# EAGLE design VM-MCU_v4.5 (EAGLE 9.6.2)

## Sheet 1 of 2
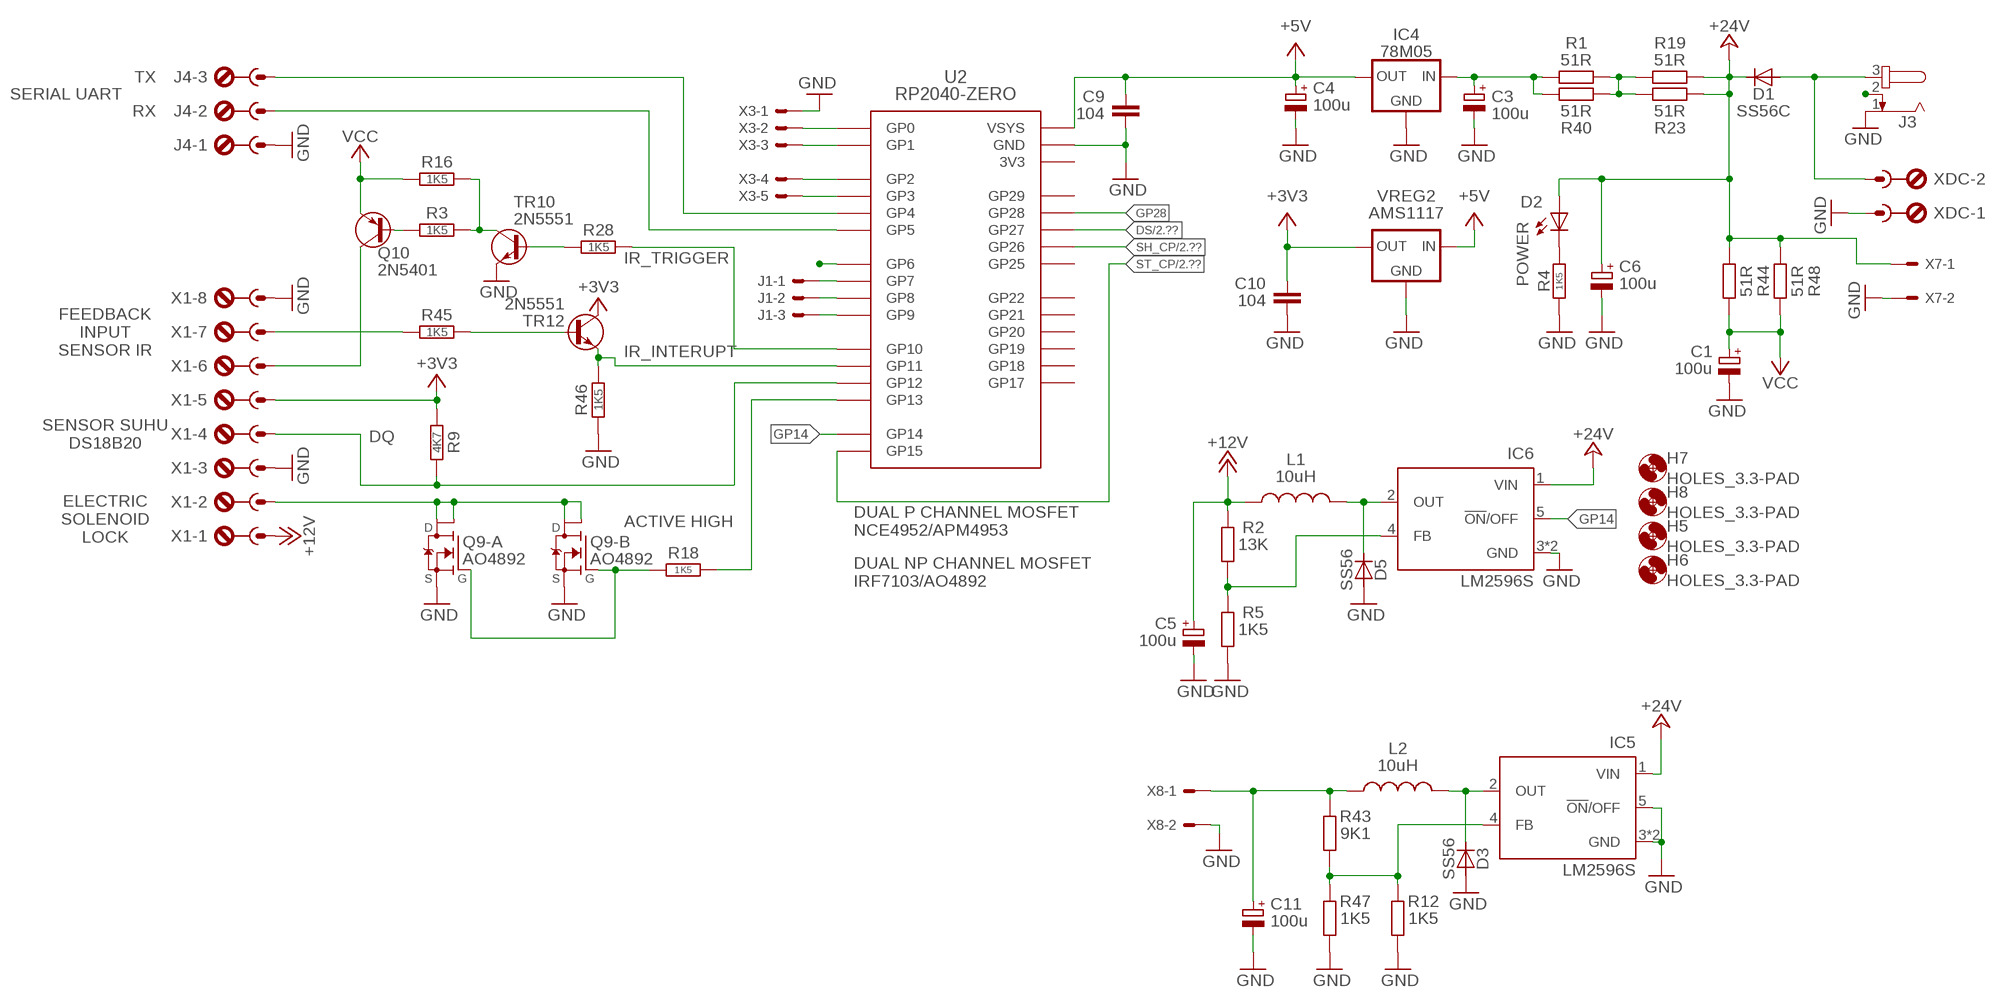
[diagram p0: schematic, sheet 1]

### Parts
C1  100u  ELCO_UD-6,3X7,7  [UD-6,3X7,7_NICHICON]
C3  100u  ELCO_UD-6,3X7,7  [UD-6,3X7,7_NICHICON]
C4  100u  ELCO_UD-6,3X7,7  [UD-6,3X7,7_NICHICON]
C5  100u  ELCO_UD-6,3X7,7  [UD-6,3X7,7_NICHICON]
C6  100u  ELCO_UD-6,3X7,7  [UD-6,3X7,7_NICHICON]
C9  104  CAP_SMD-C1206  [C1206]
C10  104  CAP_SMD-C1206  [C1206]
C11  100u  ELCO_UD-6,3X7,7  [UD-6,3X7,7_NICHICON]
D1  SS56C  DIODE_DO214AB-SMC  [DO214AB]
D2  POWER  LED2835  [LED2835]
D3  SS56  DIODE_DO214AC  [DO214AC]
D5  SS56  DIODE_DO214AC  [DO214AC]
H5  HOLES_3.3-PAD  [3,3-PAD]
H6  HOLES_3.3-PAD  [3,3-PAD]
H7  HOLES_3.3-PAD  [3,3-PAD]
H8  HOLES_3.3-PAD  [3,3-PAD]
IC4  78M05  78XXX_TO252  [TO252]
IC5  LM2596S  [TO263-5]
IC6  LM2596S  [TO263-5]
J1  SOKET-3P_JST-XH-2.54  [3P-JST-XH]
J3  JACK-DC_5.5X2.5MM  [DC-5.5X2.5]
J4  TBLOCK-3P_KF2EDG-3.81  [KF2EDG-3.81_3P]
L1  10uH  INDUKTORSMD  [CDRH127/LD]
L2  10uH  INDUKTORSMD  [CDRH127/LD]
Q9  AO4892  DUALFET-N_AO4892N+N  [SO-8]
Q10  2N5401  BJT-PNP_TO92-EBC  [TO92-EBC]
R1  51R  RESISTOR_2512  [R2512]
R2  13K  RESISTOR_1206  [R1206]
R3  1K5  RESISTOR_1206  [R1206]
R4  1K5  RESISTOR_1206  [R1206]
R5  1K5  RESISTOR_1206  [R1206]
R9  4K7  RESISTOR_1206  [R1206]
R12  1K5  RESISTOR_1206  [R1206]
R16  1K5  RESISTOR_1206  [R1206]
R18  1K5  RESISTOR_1206  [R1206]
R19  51R  RESISTOR_2512  [R2512]
R23  51R  RESISTOR_2512  [R2512]
R28  1K5  RESISTOR_1206  [R1206]
R40  51R  RESISTOR_2512  [R2512]
R43  9K1  RESISTOR_1206  [R1206]
R44  51R  RESISTOR_2512  [R2512]
R45  1K5  RESISTOR_1206  [R1206]
R46  1K5  RESISTOR_1206  [R1206]
R47  1K5  RESISTOR_1206  [R1206]
R48  51R  RESISTOR_2512  [R2512]
TR10  2N5551  BJT-NPN_TO92-EBC  [TO92-EBC]
TR12  2N5551  BJT-NPN_TO92-EBC  [TO92-EBC]
U2  RP2040-ZERO  RASPBERRY-PICO-ZERO-SMT_TYPE-C  [PICO-ZERO-SMT-C]
VREG2  AMS1117  78XXX_SOT223  [SOT223]
X1  TBLOCK-8P_KF2EDG-3.81  [KF2EDG-3.81_8P]
X3  SOKET-5P_JST-XH-2.54  [5P-JST-XH]
X7  SOKET-2P_JST-XH-2.54  [2P-JST-XH]
X8  SOKET-2P_JST-XH-2.54  [2P-JST-XH]
XDC  TBLOCK-2P_5.08MM  [KF128-5_2P]

### Nets
+3V3: C10.1 R9.1 TR12.C VREG2.4(OUT) X1.5
+5V: C4.+ C9.1 IC4.2(OUT) U2.5V(VSYS) VREG2.3(IN) ; also sheet 2
+12V: C5.+ L1.1 R2.1 X1.1
+24V: C6.+ D1.C D2.A IC5.1(VIN) IC6.1(VIN) R19.2 R23.1 R44.1 R48.1 X7.1 ; also sheet 2
DS: U2.P27(GP27) ; also sheet 2
GND: C1.- C3.- C4.- C5.- C6.- C9.2 C10.2 C11.- D3.A D5.A IC4.3(GND) IC5.3(GND) IC5.5(!ON!/OFF) IC5.6(GND) IC6.3(GND) IC6.6(GND) J3.1 J4.1 Q9.1(-A:S) Q9.3(-B:S) R4.1 R5.2 R12.2 R46.1 R47.2 TR10.E U2.G(GND) VREG2.1(GND) X1.3 X1.8 X3.1 X7.2 X8.2 XDC.1 ; also sheet 2
GP7: J1.1 U2.P7(GP7)
GP8_TX: J1.2 U2.P8(GP8)
GP9_RX: J1.3 U2.P9(GP9)
GP12: R9.2 U2.P12(GP12) X1.4
GP14: IC6.5(!ON!/OFF) U2.P14(GP14)
GP28: U2.P28(GP28)
N$1: J4.3 U2.P4(GP4)
N$2: J4.2 U2.P5(GP5)
N$3: D1.A J3.3 XDC.2
N$4: D2.C R4.2
N$5: C3.+ IC4.1(IN) R1.1 R40.2
N$6: R3.2 R16.2 TR10.C
N$7: Q10.B R3.1
N$8: R1.2 R19.1 R23.2 R40.1
N$10: U2.P6(GP6)
N$13: U2.P1(GP1) X3.3
N$23: Q10.E X1.6
N$25: U2.P0(GP0) X3.2
N$33: Q9.2(-A:G) Q9.4(-B:G) R18.2
N$34: D3.C IC5.2(OUT) L2.2
N$43: J3.2
N$46: U2.P2(GP2) X3.4
N$47: U2.P3(GP3) X3.5
N$53: C11.+ L2.1 R43.1 X8.1
N$60: Q9.5(-B:D1) Q9.6(-B:D2) Q9.7(-A:D2) Q9.8(-A:D1) X1.2
N$68: D5.C IC6.2(OUT) L1.2
N$71: IC6.4(FB) R2.2 R5.1
N$72: IC5.4(FB) R12.1 R43.2 R47.1
N$73: R28.1 TR10.B
N$74: R45.1 TR12.B
N$86: R45.2 X1.7
P10: R28.2 U2.P10(GP10)
P11: R46.2 TR12.E U2.P11(GP11)
P13: R18.1 U2.P13(GP13)
SH_CP: U2.P26(GP26) ; also sheet 2
ST_CP: U2.P15(GP15) ; also sheet 2
VCC: C1.+ Q10.C R16.1 R44.2 R48.2
Unconnected: U2.P17(GP17) U2.P18(GP18) U2.P19(GP19) U2.P20(GP20) U2.P21(GP21) U2.P22(GP22) U2.P25(GP25) U2.P29(GP29)

### Notes on the sheet
- TX
- SERIAL UART
- RX
- IR_TRIGGER
- FEEDBACK
  INPUT
  SENSOR IR
- IR_INTERUPT
- SENSOR SUHU
  DS18B20
- DQ
- ELECTRIC
  SOLENOID
  LOCK
- ACTIVE HIGH
- DUAL P CHANNEL MOSFET
  NCE4952/APM4953
- DUAL NP CHANNEL MOSFET
  IRF7103/AO4892

## Sheet 2 of 2
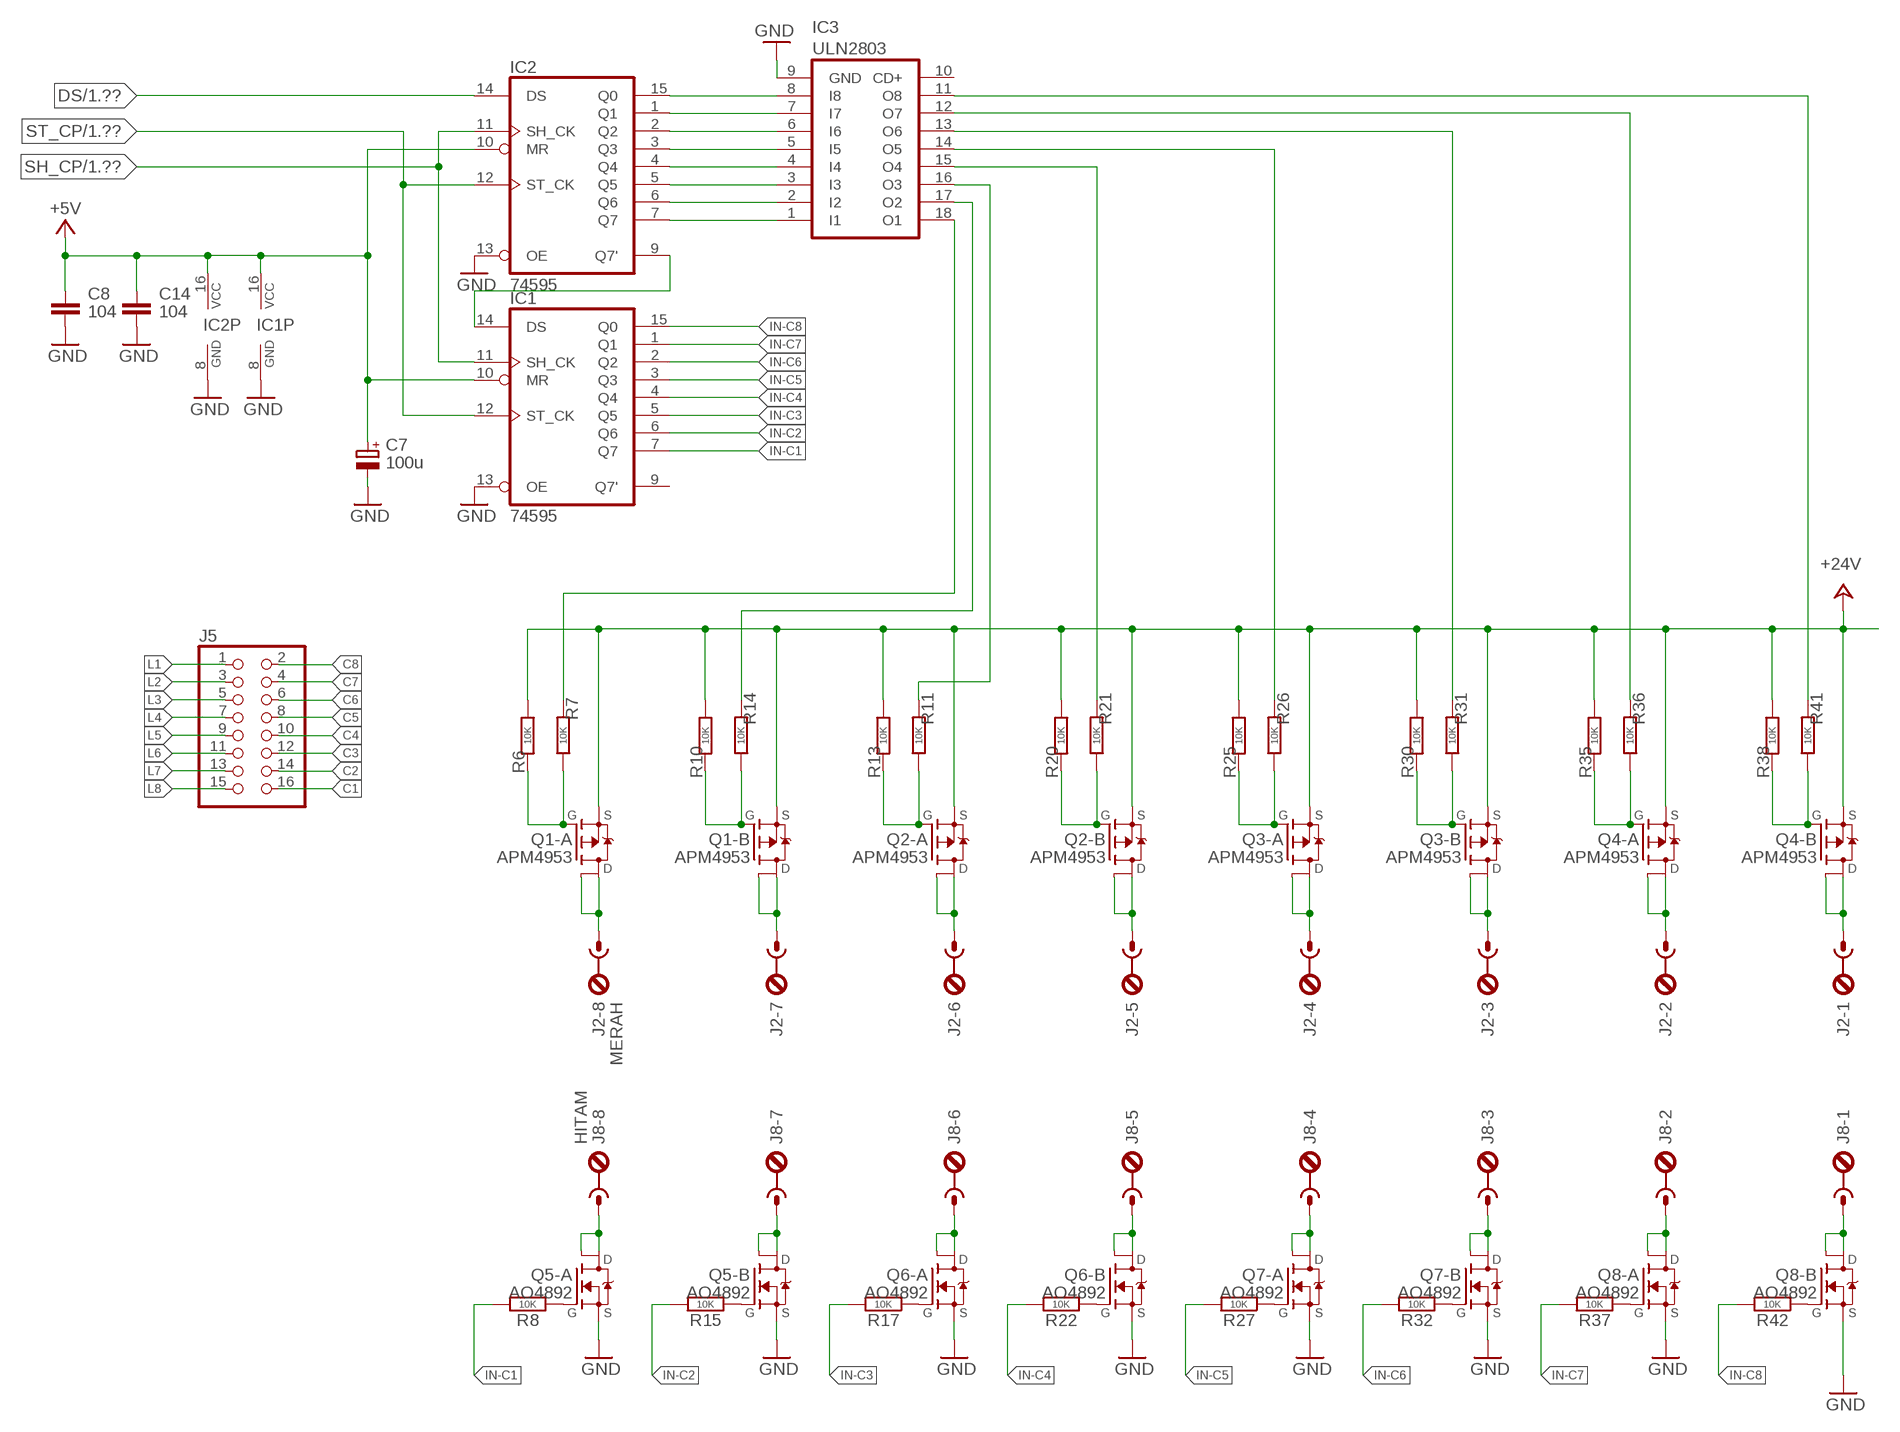
[diagram p1: schematic, sheet 2]

### Parts
C7  100u  ELCO_UD-6,3X7,7  [UD-6,3X7,7_NICHICON]
C8  104  CAP_SMD-C1206  [C1206]
C14  104  CAP_SMD-C1206  [C1206]
IC1  74595  [SO16]
IC2  74595  [SO16]
IC3  ULN2803  ULN2805ASO18  [SO18W]
J2  MERAH  TBLOCK-8P_KF2EDG-3.81  [KF2EDG-3.81_8P]
J5  PINHEAD_2X8SMT  [PINHEAD-SMT_2X08]
J8  HITAM  TBLOCK-8P_KF2EDG-3.81  [KF2EDG-3.81_8P]
Q1  APM4953  DUALFET-P_NCE4953P+P  [SO-8]
Q2  APM4953  DUALFET-P_NCE4953P+P  [SO-8]
Q3  APM4953  DUALFET-P_NCE4953P+P  [SO-8]
Q4  APM4953  DUALFET-P_NCE4953P+P  [SO-8]
Q5  AO4892  DUALFET-N_AO4892N+N  [SO-8]
Q6  AO4892  DUALFET-N_AO4892N+N  [SO-8]
Q7  AO4892  DUALFET-N_AO4892N+N  [SO-8]
Q8  AO4892  DUALFET-N_AO4892N+N  [SO-8]
R6  10K  RESISTOR_1206  [R1206]
R7  10K  RESISTOR_1206  [R1206]
R8  10K  RESISTOR_1206  [R1206]
R10  10K  RESISTOR_1206  [R1206]
R11  10K  RESISTOR_1206  [R1206]
R13  10K  RESISTOR_1206  [R1206]
R14  10K  RESISTOR_1206  [R1206]
R15  10K  RESISTOR_1206  [R1206]
R17  10K  RESISTOR_1206  [R1206]
R20  10K  RESISTOR_1206  [R1206]
R21  10K  RESISTOR_1206  [R1206]
R22  10K  RESISTOR_1206  [R1206]
R25  10K  RESISTOR_1206  [R1206]
R26  10K  RESISTOR_1206  [R1206]
R27  10K  RESISTOR_1206  [R1206]
R30  10K  RESISTOR_1206  [R1206]
R31  10K  RESISTOR_1206  [R1206]
R32  10K  RESISTOR_1206  [R1206]
R35  10K  RESISTOR_1206  [R1206]
R36  10K  RESISTOR_1206  [R1206]
R37  10K  RESISTOR_1206  [R1206]
R38  10K  RESISTOR_1206  [R1206]
R41  10K  RESISTOR_1206  [R1206]
R42  10K  RESISTOR_1206  [R1206]

### Nets
+5V: C7.+ C8.1 C14.1 IC1.10(MR) IC1.16(VCC) IC2.10(MR) IC2.16(VCC) ; also sheet 1
+24V: Q1.1(-A:S) Q1.3(-B:S) Q2.1(-A:S) Q2.3(-B:S) Q3.1(-A:S) Q3.3(-B:S) Q4.1(-A:S) Q4.3(-B:S) R6.1 R10.1 R13.1 R20.1 R25.1 R30.1 R35.1 R38.1 ; also sheet 1
C1: J5.16 J8.8 Q5.7(-A:D2) Q5.8(-A:D1)
C2: J5.14 J8.7 Q5.5(-B:D1) Q5.6(-B:D2)
C3: J5.12 J8.6 Q6.7(-A:D2) Q6.8(-A:D1)
C4: J5.10 J8.5 Q6.5(-B:D1) Q6.6(-B:D2)
C5: J5.8 J8.4 Q7.7(-A:D2) Q7.8(-A:D1)
C6: J5.6 J8.3 Q7.5(-B:D1) Q7.6(-B:D2)
C7: J5.4 J8.2 Q8.7(-A:D2) Q8.8(-A:D1)
C8: J5.2 J8.1 Q8.5(-B:D1) Q8.6(-B:D2)
DS: IC2.14(DS) ; also sheet 1
GND: C7.- C8.2 C14.2 IC1.8(GND) IC1.13(OE) IC2.8(GND) IC2.13(OE) IC3.9(GND) Q5.1(-A:S) Q5.3(-B:S) Q6.1(-A:S) Q6.3(-B:S) Q7.1(-A:S) Q7.3(-B:S) Q8.1(-A:S) Q8.3(-B:S) ; also sheet 1
IN-C1: IC1.7(Q7) R8.2
IN-C2: IC1.6(Q6) R15.2
IN-C3: IC1.5(Q5) R17.2
IN-C4: IC1.4(Q4) R22.2
IN-C5: IC1.3(Q3) R27.2
IN-C6: IC1.2(Q2) R32.2
IN-C7: IC1.1(Q1) R37.2
IN-C8: IC1.15(Q0) R42.2
L1: J2.8 J5.1 Q1.7(-A:D2) Q1.8(-A:D1)
L2: J2.7 J5.3 Q1.5(-B:D1) Q1.6(-B:D2)
L3: J2.6 J5.5 Q2.7(-A:D2) Q2.8(-A:D1)
L4: J2.5 J5.7 Q2.5(-B:D1) Q2.6(-B:D2)
L5: J2.4 J5.9 Q3.7(-A:D2) Q3.8(-A:D1)
L6: J2.3 J5.11 Q3.5(-B:D1) Q3.6(-B:D2)
L7: J2.2 J5.13 Q4.7(-A:D2) Q4.8(-A:D1)
L8: J2.1 J5.15 Q4.5(-B:D1) Q4.6(-B:D2)
N$12: IC2.15(Q0) IC3.8(I8)
N$15: IC2.1(Q1) IC3.7(I7)
N$16: Q1.2(-A:G) R6.2 R7.1
N$18: IC3.17(O2) R14.2
N$19: Q5.2(-A:G) R8.1
N$20: Q1.4(-B:G) R10.2 R14.1
N$21: IC2.2(Q2) IC3.6(I6)
N$22: Q2.2(-A:G) R11.1 R13.2
N$26: IC2.3(Q3) IC3.5(I5)
N$27: Q5.4(-B:G) R15.1
N$29: IC2.4(Q4) IC3.4(I4)
N$31: IC3.18(O1) R7.2
N$32: Q2.4(-B:G) R20.2 R21.1
N$35: Q6.2(-A:G) R17.1
N$37: IC2.5(Q5) IC3.3(I3)
N$38: IC2.6(Q6) IC3.2(I2)
N$39: IC2.7(Q7) IC3.1(I1)
N$40: IC3.16(O3) R11.2
N$41: IC3.15(O4) R21.2
N$42: Q3.2(-A:G) R25.2 R26.1
N$44: Q6.4(-B:G) R22.1
N$48: IC3.14(O5) R26.2
N$49: Q3.4(-B:G) R30.2 R31.1
N$51: Q7.2(-A:G) R27.1
N$55: IC3.13(O6) R31.2
N$56: Q4.2(-A:G) R35.2 R36.1
N$58: Q7.4(-B:G) R32.1
N$62: IC3.12(O7) R36.2
N$63: Q4.4(-B:G) R38.2 R41.1
N$65: Q8.2(-A:G) R37.1
N$69: IC3.11(O8) R41.2
N$70: Q8.4(-B:G) R42.1
N$84: IC1.14(DS) IC2.9(Q7')
SH_CP: IC1.11(SH_CK) IC2.11(SH_CK) ; also sheet 1
ST_CP: IC1.12(ST_CK) IC2.12(ST_CK) ; also sheet 1
Unconnected: IC1.9(Q7') IC3.10(CD+)

## Power pins joined to a net without a drawn wire
3V3: U2.3V3

## Library data of the parts
C1 C3-C7 C11 = MyFavorite:ELCO_: POLARIZED CAPACITOR, European symbol; SPICEPREFIX: C
C8-C10 C14 = MyFavorite:CAP_: CAPACITOR, European symbol
D1 D3 D5 = MyFavorite:DIODE_
D2 = MyFavorite:LED
H5-H8 = MyFavorite:HOLES_: MOUNTING HOLE with drill center marker
IC1 IC2 = VM-MCU:74*595: 8-bit SHIFT REGISTER, output latch
IC3 = VM-MCU:ULN2805A: DRIVER ARRAY
IC4 VREG2 = VM-MCU:78XXX_: VOLTAGE REGULATOR
IC5 IC6 = VM-MCU:LM2596: SIMPLE SWITCHER® Power Converter 150 kHz 3A Step-Down Voltage Regulator Source: http://www.national.com/ds/LM/LM2596.pdf; MF: NATIONAL SEMICONDUCTOR; MPN: LM2596S-ADJ/NOPB; OC_FARNELL: 9494367; OC_NEWARK: 41K3842
J1 = MYConnector:SOKET-3P_: KK 156 HEADER Source: http://www.molex.com/pdm_docs/sd/026604100_sd.pdf
J2 J8 X1 = MYConnector:TBLOCK-8P_: PHOENIX
J3 = MyFavorite:JACK-DC_: DC POWER JACK Power Jack, DC, Right Angle, Through Hole, Rated 5A at 16VDC, PC Terminals Distributor: Farnell (www.Farnell.de) Drawing: 84N1161.pdf / 84N1162.pdf Manufacturer: SPC Technology (www.spctechnology.com) Type: SPC4077 / SPC 4078
J4 = MYConnector:TBLOCK-3P_
J5 = MYConnector:PINHEAD_2X8
L1 L2 = MyFavorite:INDUKTOR
Q1-Q4 = VM-MCU:DUALFET-P_
Q5-Q9 = VM-MCU:DUALFET-N_
Q10 = VM-MCU:BJT-PNP_: PNP Transistror
R1 R4 R6-R8 R10 R11 R13-R15 R17 R19-R23 R25-R27 R30-R32 R35-R38 R40-R42 R44 R45 R48 = MyFavorite:RESISTOR_: RESISTOR, European symbol
R2 R3 R5 R9 R12 R16 R18 R28 R43 R46 R47 = VM-MCU:RESISTOR_: RESISTOR, European symbol
TR10 TR12 = VM-MCU:BJT-NPN_: NPN Transistror BF959 corrected 2008.03.06
U2 = VM-MCU:RASPBERRY-PICO-ZERO-SMT_
X3 = MYConnector:SOKET-5P_: KK 156 HEADER Source: http://www.molex.com/pdm_docs/sd/026604100_sd.pdf
X7 X8 = MYConnector:SOKET-2P_: KK 156 HEADER Source: http://www.molex.com/pdm_docs/sd/026604100_sd.pdf
XDC = MYConnector:TBLOCK-2P_

## Board
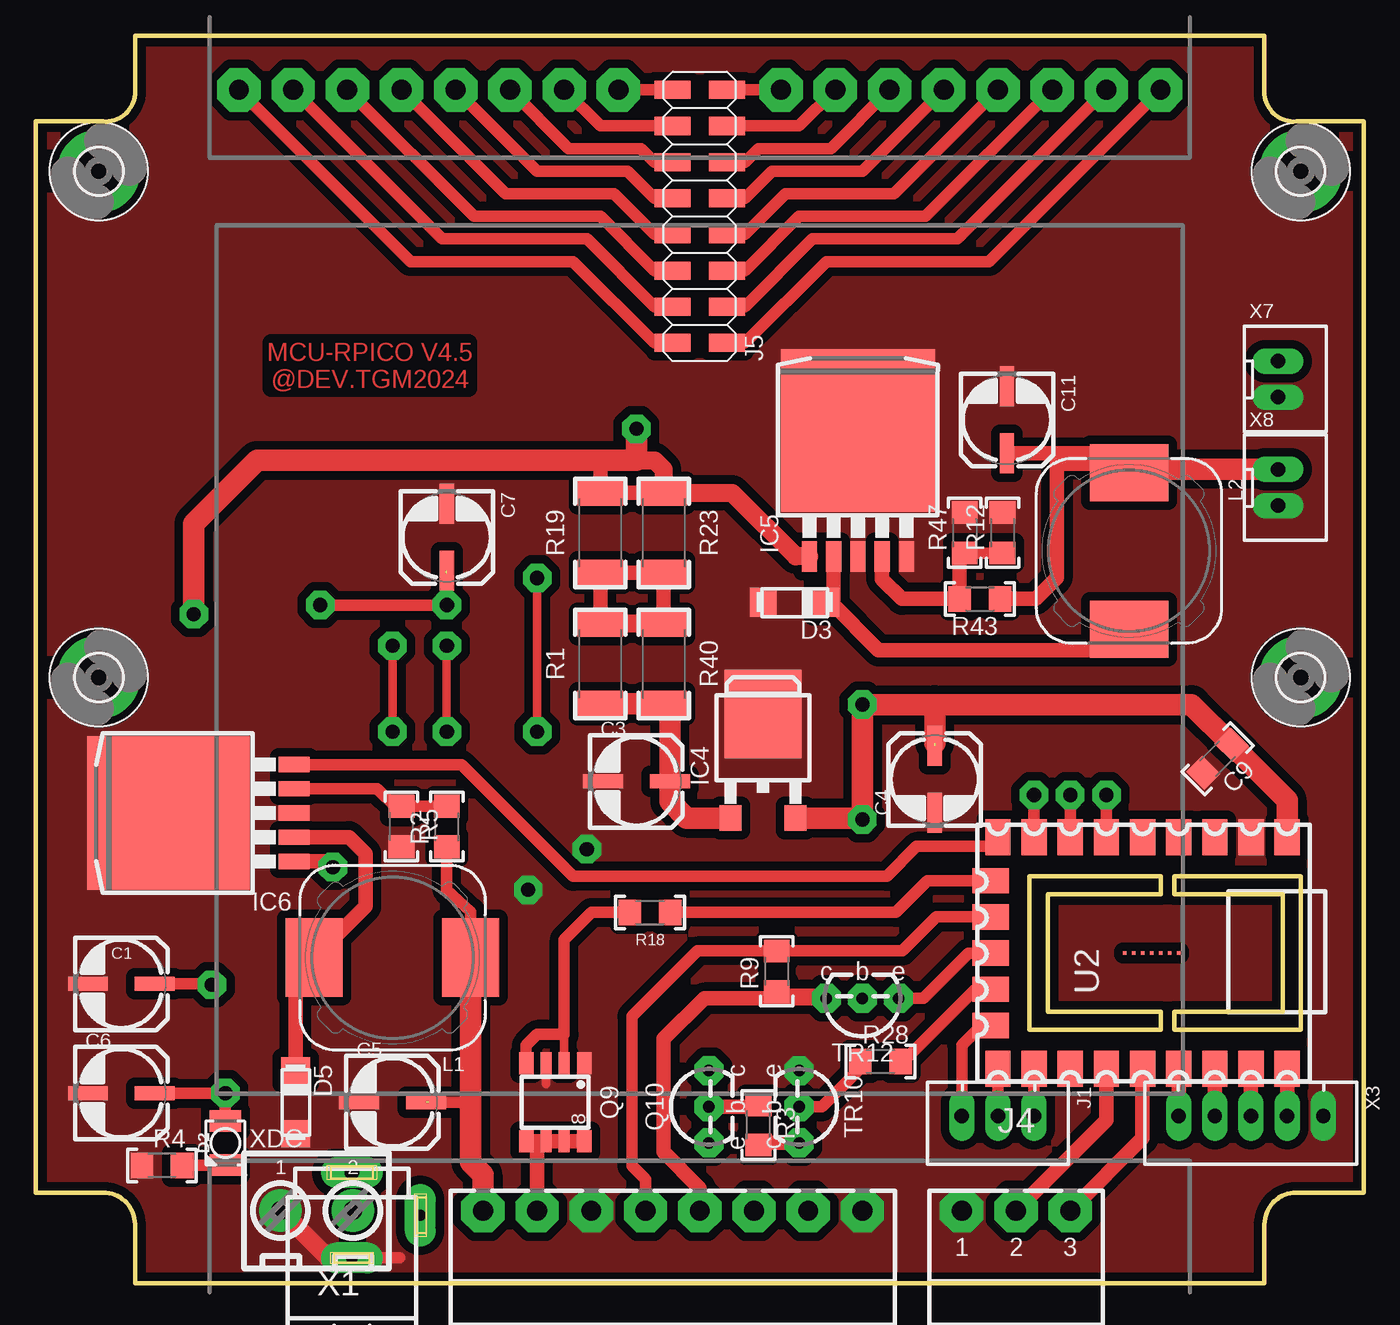
[diagram p2: board, top side]
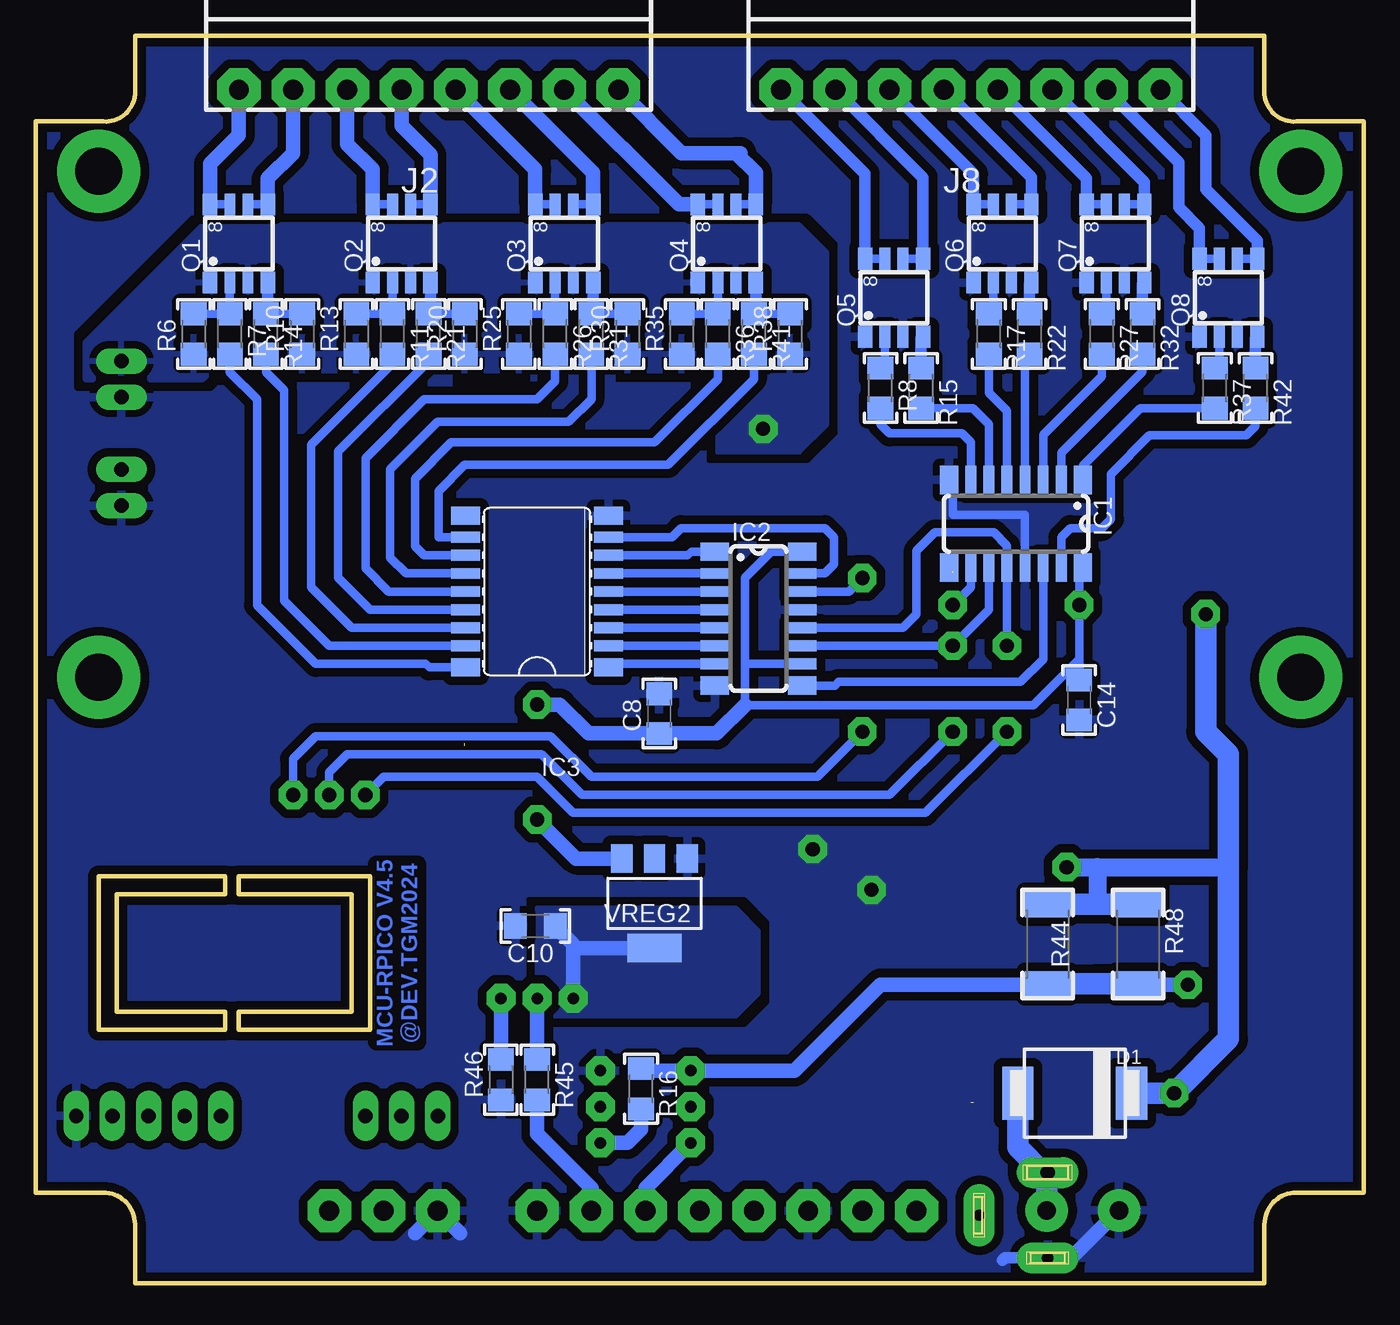
[diagram p3: board, bottom side, seen from below]

Size 93.34 x 87.63 mm. Coordinates in mm from the lower left corner, seen from the top.
Outline: 86.36,87.63 6.98,87.63 6.98,83.5 arc-90 4.76,81.6 0,81.6 0,6.35 4.76,6.35 arc-90 6.98,4.13 6.98,0 86.36,0 86.36,4.13 arc-90 88.58,6.35 93.35,6.35 93.35,81.6 88.58,81.6 arc-90 86.36,83.5 86.36,87.63
Outline: 69.85,28.57 69.85,17.78 79.06,17.78 79.06,19.05 71.12,19.05 71.12,27.3 79.06,27.3 79.06,28.57 69.85,28.57
Outline: 80.01,17.78 88.9,17.78 88.9,28.57 80.01,28.57 80.01,27.3 87.63,27.3 87.63,19.05 80.01,19.05 80.01,17.78
Copper layers (1*16): Top 0.035mm / dielectric 1.5mm / Bottom 0.035mm
Design rules "default *": minimum track width 6mil, minimum drill 0.35mm, track to track 24mil, track to pad 6mil, pad to pad 6mil, via to via 6mil, smd to smd 0mil, copper to edge 24mil, drill to drill 6mil, minimum pad ring 10mil, minimum via ring 8mil, stop-mask expansion 4mil, vias tented up to drill 0mil, thermal gap 20mil

### Footprints (pad centres in the part's own frame; a part is rotated, then mirrored left to right if it is on the bottom)
UD-6,3X7,7_NICHICON = smd 2.8 x 1: + 2.35,0; - -2.35,0
C1206 = smd 1.6 x 1.8: 1 -1.4,0; 2 1.4,0
DO214AB = smd 2.2 x 3.7: A 4,0; C -4,0
LED2835 = smd 1.5 x 2.2: A -1.55,0; C 1.55,0
DO214AC = smd 1.88 x 2.032: A 2.21,0; C -2.21,0
3,3-PAD = drill 3.3 pad 5.842: 3.3 0,0
SO16 = smd 1.27 x 2.032: 1 -4.699,-3.073; 8 4.699,-3.073; 9 4.699,3.073; 16 -4.699,3.073 | smd 0.762 x 2.032: 2 -3.175,-3.073; 3 -1.905,-3.073; 4 -0.635,-3.073; 5 0.635,-3.073; 6 1.905,-3.073; 7 3.175,-3.073; 10 3.175,3.073; 11 1.905,3.073; 12 0.635,3.073; 13 -0.635,3.073; 14 -1.905,3.073; 15 -3.175,3.073
SO18W = smd 1.27 x 2.032: 1 -5.334,-5.029; 9 5.334,-5.029; 10 5.334,5.029; 18 -5.334,5.029 | smd 0.762 x 2.032: 2 -3.81,-5.029; 3 -2.54,-5.029; 4 -1.27,-5.029; 5 0,-5.029; 6 1.27,-5.029; 7 2.54,-5.029; 8 3.81,-5.029; 11 3.81,5.029; 12 2.54,5.029; 13 1.27,5.029; 14 0,5.029; 15 -1.27,5.029; 16 -2.54,5.029; 17 -3.81,5.029
TO252 = smd 1.524 x 1.778: 1 -2.28,-4.8; 2 2.28,-4.8 | smd 5.4 x 6.2: 3 0,2.5
TO263-5 = smd 1.067 x 2.159: 1 -3.404,-5.791; 2 -1.702,-5.791; 3 0,-5.791; 4 1.702,-5.791; 5 3.404,-5.791 | smd 10.8 x 11.43: 6 0,3.048
3P-JST-XH = drill 1.016 pad 1.778 long: 1 -2.54,0; 2 0,0; 3 2.54,0
KF2EDG-3.81_8P = drill 1.4 pad 3.048 octagon: 1 0,0; 2 3.81,0; 3 7.62,0; 4 11.43,0; 5 15.24,0; 6 19.05,0; 7 22.86,0; 8 26.67,0
DC-5.5X2.5 = drill 0.8 pad 2.184 long: 1 -3,0; 2 0,-4.8 | drill 1 pad 2.184 long: 3 3,0
KF2EDG-3.81_3P = drill 1.4 pad 3.048 octagon: 1 -3.81,0; 2 0,0; 3 3.81,0
PINHEAD-SMT_2X08 = smd 1.27 x 2.54: 1 0,-0.635; 2 0,3.175; 3 2.54,-0.635; 4 2.54,3.175; 5 5.08,-0.635; 6 5.08,3.175; 7 7.62,-0.635; 8 7.62,3.175; 9 10.16,-0.635; 10 10.16,3.175; 11 12.7,-0.635; 12 12.7,3.175; 13 15.24,-0.635; 14 15.24,3.175; 15 17.78,-0.635; 16 17.78,3.175
CDRH127/LD = smd 4 x 5.5: 1 -5.5,0; 2 5.5,0
SO-8 = smd 1.524 x 1.016: 1 -2.743,2.032; 4 -2.743,-2.032; 5 2.743,-2.032; 8 2.743,2.032 | smd 1.524 x 0.762: 2 -2.743,0.635; 3 -2.743,-0.635; 6 2.743,-0.635; 7 2.743,0.635
TO92-EBC = drill 0.813 pad 2.032 octagon: B 0,-1.27; C 2.54,-1.27; E -2.54,-1.27
R2512 = smd 1.8 x 3.2: 1 -2.8,0; 2 2.8,0
R1206 = smd 1.6 x 1.803: 1 -1.422,0; 2 1.422,0
PICO-ZERO-SMT-C = smd 2.54 x 1.778: 3V3 -0.508,-5.08; 5V -0.508,0; G -0.508,-2.54; P0 15.748,0; P1 15.748,-2.54; P2 15.748,-5.08; P3 15.748,-7.62; P4 15.748,-10.16; P5 15.748,-12.7; P6 15.748,-15.24; P7 15.748,-17.78; P8 15.748,-20.32; P14 -0.508,-20.32; P15 -0.508,-17.78; P26 -0.508,-15.24; P27 -0.508,-12.7; P28 -0.508,-10.16; P29 -0.508,-7.62 | smd 1.778 x 2.54: P9 12.7,-20.828; P10 10.16,-20.828; P11 7.62,-20.828; P12 5.08,-20.828; P13 2.54,-20.828 | smd 0.254 x 0.254: P17 7.62,-11.43; P18 7.62,-10.795; P19 7.62,-10.16; P20 7.62,-9.525; P21 7.62,-8.89; P22 7.62,-8.255; P25 7.62,-7.62
SOT223 = smd 1.5 x 2: 1 -2.3,-3.15; 2 0,-3.15; 3 2.3,-3.15 | smd 3.8 x 2: 4 0,3.15
5P-JST-XH = drill 1.016 pad 1.778 long: 1 -5.08,0; 2 -2.54,0; 3 0,0; 4 2.54,0; 5 5.08,0
2P-JST-XH = drill 1.016 pad 1.778 long: 1 -1.27,0; 2 1.27,0
KF128-5_2P = drill 1.3 pad 3: 1 -2.561,0.025; 2 2.519,0.025

### Placement (x,y rotation side)
C1  6.03,21.02 0 top
C3  42.23,35.24 0 top
C4  63.18,35.38 90 top
C5  25.08,12.7 0 top
C6  6.03,13.33 0 top
C7  28.89,52.39 270 top
C8  49.53,40 90 bottom
C9  83.06,36.83 225 top
C10  58.23,25.08 180 bottom
C11  68.26,60.64 270 top
C14  20,40.96 270 bottom
D1  20.32,13.33 180 bottom
D2  13.33,9.84 270 top
D3  53.34,47.82 180 top
D5  18.28,12.7 270 top
H5  88.9,42.54 0 top
H6  4.44,42.54 0 top
H7  88.9,78.1 0 top
H8  4.44,78.1 0 top
IC1  24.45,53.34 180 bottom
IC2  42.54,46.67 270 bottom
IC3  58.1,48.58 90 bottom
IC4  51.12,37.46 0 top
IC5  57.78,56.83 0 top
IC6  12.38,33.02 90 top
J1  67.63,11.75 180 top
J2  52.39,83.82 180 bottom
J3  22.22,4.76 90 top
J4  68.9,5.08 0 top
J5  47.94,66.04 90 top
J8  14.29,83.82 180 bottom
L1  25.08,22.86 180 top
L2  76.83,51.43 270 top
Q1  79.06,73.02 90 bottom
Q2  67.63,73.02 90 bottom
Q3  56.2,73.02 90 bottom
Q4  44.77,73.02 90 bottom
Q5  33.02,69.21 90 bottom
Q6  25.4,73.02 90 bottom
Q7  17.46,73.02 90 bottom
Q8  9.52,69.21 90 bottom
Q9  36.51,12.7 270 top
Q10  46.04,12.38 90 top
R1  39.69,43.5 90 top
R2  28.89,32.07 90 top
R3  50.8,11.11 270 top
R4  8.89,8.25 0 top
R5  25.72,32.07 270 top
R6  82.23,66.67 90 bottom
R7  79.69,66.67 270 bottom
R8  33.97,62.86 270 bottom
R9  52.07,21.91 90 top
R10  74.61,66.67 90 bottom
R11  68.26,66.67 270 bottom
R12  67.94,52.7 90 top
R13  70.8,66.67 90 bottom
R14  77.15,66.67 270 bottom
R15  31.11,62.86 270 bottom
R16  50.8,13.65 270 bottom
R17  26.35,66.67 270 bottom
R18  43.18,26.03 180 top
R19  39.69,52.7 90 top
R20  63.18,66.67 90 bottom
R21  65.72,66.67 270 bottom
R22  23.5,66.67 270 bottom
R23  44.13,52.7 270 top
R25  59.37,66.67 90 bottom
R26  56.83,66.67 270 bottom
R27  18.41,66.67 270 bottom
R28  59.37,15.56 0 top
R30  51.75,66.67 90 bottom
R31  54.29,66.67 270 bottom
R32  15.56,66.67 270 bottom
R35  47.94,66.67 90 bottom
R36  45.4,66.67 270 bottom
R37  10.48,62.86 270 bottom
R38  40.32,66.67 90 bottom
R40  44.13,43.5 270 top
R41  42.86,66.67 270 bottom
R42  7.62,62.86 270 bottom
R43  66.36,48.06 180 top
R44  22.22,23.81 270 bottom
R45  58.1,14.29 270 bottom
R46  60.64,14.29 90 bottom
R47  65.29,52.7 90 top
R48  15.88,23.81 270 bottom
TR10  54.93,12.38 270 top
TR12  58.1,18.73 180 top
U2  87.95,30.8 270 top
U$1  [BOX-PLC_115X90]  46.67,43.81 0 top
VREG2  49.85,26.67 180 bottom
X1  31.43,5.08 0 top
X3  85.41,11.75 180 top
X7  87.31,63.5 270 top
X8  87.31,55.88 270 top
XDC  19.77,5.08 0 top

### Tracks (layer width: path | path; a pad name or v marks a point on that pad's centre or on a via)
+3V3
  Top 1.016: R9.1 52.39,20.17 55.4,20.17 TR12.C 46.99,20 44.13,17.14 44.13,9.21 46.67,6.67 X1.5
  Bottom 1.016: TR12.C 55.56,23.52 VREG2.4 | C10.1 55.56,23.81
  pour Bottom (isolate 0.61, no thermals): 58.1,18.73 44.13,18.73 42.54,20.32 42.54,24.76 44.13,26.35 58.1,26.35
+5V  (via drill 1 pad 2)  (2 unrouted)
  Top 0.813: v20,47.62 v28.89,47.62 28.89,49.85
  Top 1.016: v58.1,40.64 v58.1,32.56
  Top 1.524: U2.5V 87.95,33.92 C9.1 81.23,40.64 v58.1,40.64 | v58.1,40.64 58.1,32.92 57.84,32.66 IC4.2 | v58.1,40.64 63.18,40.64 63.18,37.92
  Bottom 0.61: IC1.10 27.62,48.89 v28.89,47.62 | 43.5,43.5 43.5,49.53 41.66,51.37 IC2.16 | IC2.10 43.5,43.5 | v20,47.62 C14.1 | v20,47.62 20,43.81 23.23,40.59 43.5,40.59 43.5,43.5 | IC1.16 20,50.01 v20,47.62
  Bottom 1.016: v58.1,32.56 55.36,29.82 VREG2.3 | 43.5,40.59 45.48,38.6 C8.1 54.48,38.6 56.51,40.64 v58.1,40.64
+12V  (1 unrouted)
  Top 0.813: L1.1 30.58,26.08 28.89,27.63 R2.1 | 27.62,12.7 29.95,12.7 30.58,12.06
  Top 1.524: L1.1 30.58,12.06 30.58,8.47 31.43,7.62 X1.1
+24V  (via drill 1 pad 2)
  Top 0.813: D2.A v13.33,13.33 C6.+
  Top 1.016: IC6.1 20.49,29.62 v20.89,29.21 | R23.1 R19.2 39.69,57.78
  Top 1.27: 42.23,57.78 43.5,57.78 44.13,57.15 R23.1 48.95,55.5 49.21,55.24 53.42,51.04 IC5.1
  Top 1.524: v42.23,60.01 42.23,57.78 39.69,57.78 15.56,57.78 11.11,53.34 v11.11,46.99
  Bottom 1.27: v20.89,29.21 18.73,29.21 | 18.73,29.21 9.52,29.21 | 18.73,29.21 18.73,26.61
  Bottom 1.524: v11.11,46.99 11.11,38.73 9.52,37.15 9.52,29.21 9.52,17.14 v13.33,13.33 D1.C 16.51,13.33 | R48.1 18.73,26.61 R44.1
  pour Bottom (isolate 0.61): 81.6,63.5 80.96,64.13 45.4,64.13 45.4,58.42 39.69,58.42 37.78,60.32 37.78,72.39 39.69,74.29 81.6,74.29 89.85,66.04 89.85,63.5
C1
  Top 0.813: J8.8 J5.16
  Bottom 0.61: Q5.7 Q5.8
  Bottom 0.813: J8.8 35.05,77.91 Q5.8
C2
  Top 0.813: J8.7 39.69,81.28 J5.14
  Bottom 0.61: Q5.5 Q5.6
  Bottom 0.813: Q5.5 30.99,77.66 J8.7
C3
  Top 0.813: J8.6 37.47,79.69 42.54,79.69 43.5,78.74 J5.12
  Bottom 0.61: Q6.7 Q6.8
  Bottom 0.813: J8.6 27.43,77.91 Q6.8
C4
  Top 0.813: J8.5 35.24,78.1 41.59,78.1 43.5,76.2 J5.10
  Bottom 0.61: Q6.5 Q6.6
  Bottom 0.813: Q6.5 23.37,77.67 J8.5
C5
  Top 0.813: J8.4 33.02,76.52 40.64,76.52 43.5,73.66 J5.8
  Bottom 0.61: Q7.7 Q7.8
  Bottom 0.813: Q7.8 19.49,77.6 J8.4
C6
  Top 0.813: J8.3 30.8,74.93 39.69,74.93 43.5,71.12 J5.6
  Bottom 0.61: Q7.5 Q7.6
  Bottom 0.813: Q7.5 15.43,77.34 J8.3
C7
  Top 0.813: J8.2 28.57,73.34 38.73,73.34 43.5,68.58 J5.4
  Bottom 0.61: Q8.7 Q8.8
  Bottom 0.813: J8.2 13.02,78.74 13.02,75.56 11.56,74.1 Q8.8
C8
  Top 0.813: J8.1 26.35,71.75 37.78,71.75 43.5,66.04 J5.2
  Bottom 0.61: Q8.5 Q8.6
  Bottom 0.813: J8.1 11.11,80.64 11.11,76.83 7.49,73.21 Q8.5
DS  (via drill 1 pad 2)
  Top 0.61: v35.24,49.53 v35.24,38.73 | v75.25,34.29 75.25,33.65
  Top 0.813: 75.25,33.65 U2.P27
  Bottom 0.61: IC2.14 36.2,48.58 v35.24,49.53 | v35.24,38.73 38.42,35.56 54.29,35.56 57.15,38.42 73.66,38.42 75.25,36.83 v75.25,34.29
GND  (via drill 1 pad 2)
  Top 0.61: Q9.3 35.88,13.97
  Top 0.813: J3.1 25.57,1.76
  Top 1.27: J3.1 20.56,1.76 XDC.1
  Bottom 0.61: 28.89,56.41 28.89,53.97 23.81,53.97 IC1.13
  Bottom 0.813: J3.1 25.23,1.76 25.4,1.59
  Bottom 1.016: J3.1 20.56,1.76 XDC.1 | 63.5,3.49 J4.1 66.67,3.49
  other vias: 34.61,27.62 38.73,30.48
  pour Top (isolate 0.61, rank 3, no thermals): 85.41,86.99 7.94,86.99 7.94,84.74 arc-90 4.16,80.96 0.95,80.96 0.95,6.98 3.66,6.98 arc-90 7.94,2.71 7.94,0.63 85.72,0.63 85.72,3.34 arc-90 89.37,6.98 92.39,6.98 92.39,80.64 88.73,80.64 arc-90 85.41,83.97
  pour Bottom (isolate 0.508, rank 2): 85.41,86.99 7.94,86.99 7.94,84.37 arc-90 4.21,80.64 0.95,80.64 0.95,6.98 3.66,6.98 arc-90 7.94,2.71 7.94,0.63 85.72,0.63 85.72,3.21 arc-90 89.5,6.98 92.39,6.98 92.39,80.64 89.32,80.64 arc-90 85.41,84.56
GP7
  Top 0.813: J1.1 U2.P7
GP8_TX
  Top 0.813: U2.P8 J1.2
GP9_RX
  Top 0.813: U2.P9 66.48,18.1 65.09,16.7 J1.3
GP12
  Top 0.813: U2.P12 63.31,25.72 60.92,23.33 R9.2 46.51,23.33 41.91,18.73 41.91,8.25 42.86,7.3 X1.4
GP14
  Top 0.813: IC6.5 29.93,36.42 37.78,28.57 59.82,28.57 61.91,30.67 66.99,30.67 U2.P14
IN-C1
  Bottom 0.61: 33.97,61.28 R8.2 33.97,60.32 33.34,59.69 28.26,59.69 27.62,59.05 IC1.7
IN-C2
  Bottom 0.61: IC1.6 26.35,60.32 27.47,61.44 R15.2 31.11,61.28
IN-C3
  Bottom 0.61: IC1.5 25.08,61.28 26.35,62.55 R17.2
IN-C4
  Bottom 0.61: R22.2 23.81,64.94 IC1.4
IN-C5
  Bottom 0.61: IC1.3 22.54,59.59 18.42,63.72 R27.2
IN-C6
  Bottom 0.61: R32.2 15.56,64.03 21.27,58.32 IC1.2
IN-C7
  Bottom 0.61: 10.48,61.28 R37.2 15.71,61.44 19.75,57.4 IC1.1
IN-C8
  Bottom 0.61: 7.62,61.28 R42.2 7.62,60.17 8.26,59.54 15.07,59.54 17.78,56.83 17.78,53.66 18.42,53.02 20.64,53.02 21.27,52.39 IC1.15
L1
  Top 0.813: J5.1 49.85,66.04 55.56,71.75 66.99,71.75 J2.8
  Bottom 0.61: Q1.8 Q1.7
  Bottom 1.016: J2.8 79.06,80.64 81.09,78.61 Q1.8
L2
  Top 0.813: J5.3 49.85,68.58 54.61,73.34 64.77,73.34 J2.7
  Bottom 0.61: Q1.6 Q1.5
  Bottom 1.016: J2.7 75.25,79.38 77.03,77.6 Q1.5
L3
  Top 0.813: J5.5 49.85,71.12 53.66,74.93 62.55,74.93 J2.6
  Bottom 0.61: Q2.7 Q2.8
  Bottom 1.016: J2.6 71.44,80.01 69.66,78.23 Q2.8
L4
  Top 0.813: J5.7 49.85,73.66 52.7,76.52 60.32,76.52 J2.5
  Bottom 0.61: Q2.6 Q2.5
  Bottom 1.016: J2.5 67.63,81.28 65.6,79.25 Q2.5
L5
  Top 0.813: J5.9 49.85,76.2 51.75,78.1 58.1,78.1 J2.4
  Bottom 0.61: Q3.7 Q3.8
  Bottom 1.016: J2.4 58.23,78.23 Q3.8
L6
  Top 0.813: J5.11 49.85,78.74 50.8,79.69 55.88,79.69 J2.3
  Bottom 0.61: Q3.5 Q3.6
  Bottom 1.016: J2.3 54.17,77.98 Q3.5
L7
  Top 0.813: J5.13 53.66,81.28 J2.2
  Bottom 0.61: Q4.7 Q4.8
  Bottom 1.016: J2.2 48.15,75.77 Q4.8
L8
  Top 0.813: J5.15 J2.1
  Bottom 0.61: Q4.5 Q4.6
  Bottom 1.016: J2.1 47.94,79.38 44.13,79.38 | 44.13,79.38 43.82,79.38 | 44.13,79.38 42.74,77.98 Q4.5
N$1
  Top 1.016: J4.3 77.79,10.16 U2.P4
N$2
  Top 1.016: J4.2 75.25,11.43 U2.P5
N$3
  Bottom 1.524: D1.A 24.32,9.52 22.56,7.76 J3.3 22.29,7.69 XDC.2
N$4
  Top 0.813: D2.C 10.31,8.29 R4.2
N$5
  Top 1.524: R40.2 R1.1 | R40.2 43.44,40.7 | IC4.1 45.76,32.66 44.58,33.84 C3.+ 44.58,40.25 R40.2
N$6
  Top 1.016: TR10.C 50.95,9.84 R3.2
  Bottom 1.016: TR10.C 51.75,9.84 50.8,10.79 R16.2
N$7
  Top 1.016: R3.1 50.65,12.38 Q10.B
N$8
  Top 1.016: R1.2 R19.1 R23.2 R40.1
  Top 1.27: R40.1 R1.2
N$12
  Bottom 0.61: IC2.15 37.88,49.85 37.25,50.48 37.25,52.39 37.88,53.02 47.99,53.02 48.63,52.39 IC3.8
N$13
  Top 1.016: X3.3 U2.P1
N$15
  Bottom 0.61: IC3.7 47.52,51.12 47.27,51.37 IC2.1
N$16
  Bottom 0.61: Q1.2 R7.1 R6.2 82.38,68.1
N$18
  Bottom 0.61: R14.2 77.15,63.98 75.88,62.71 75.88,47.94 72.71,44.77 IC3.17
N$19
  Bottom 0.61: Q5.2 33.66,64.77 33.97,64.45 R8.1
N$20
  Bottom 0.61: R14.1 R10.2
  Bottom 0.813: Q1.4 77.03,68.22 R14.1
N$21
  Bottom 0.61: IC3.6 IC2.2
N$22
  Bottom 0.61: Q2.2 68.26,68.58 | 68.26,68.58 R11.1 | R13.2 68.75,68.1 68.26,68.58
N$23
  Bottom 1.016: X1.6 50.48,6.67 Q10.E
N$25
  Top 1.016: X3.2 U2.P0
N$26
  Bottom 0.61: IC3.5 IC2.3
N$27
  Bottom 0.813: Q5.4 31.11,66.34 R15.1
N$29
  Bottom 0.61: IC3.4 IC2.4
N$31
  Bottom 0.61: R7.2 79.69,63.98 77.79,62.08 77.79,47.62 73.66,43.5 65.93,43.5 65.67,43.24 IC3.18
N$32
  Bottom 0.61: R21.1 R20.2
  Bottom 0.813: Q2.4 65.6,68.22 R21.1
N$33
  Top 0.61: Q9.2 37.15,17.46
  Top 0.813: R18.2 39.05,26.03 37.15,24.13 37.15,17.46 35.24,17.46 34.48,16.7 Q9.4
N$34
  Top 1.016: L2.2 76.94,44.45 59.25,44.45 55.88,47.82 | 55.88,47.82 56.08,48.02 IC5.2 | D3.C 55.88,47.82
N$35
  Bottom 0.61: Q6.2 26.04,68.58 26.35,68.26 R17.1
N$37
  Bottom 0.61: IC3.3 IC2.5
N$38
  Bottom 0.61: IC3.2 IC2.6
N$39
  Bottom 0.61: IC3.1 52.82,43.5 IC2.7
N$40
  Bottom 0.61: IC3.16 71.12,46.04 73.98,48.89 73.98,58.9 68.26,64.62 R11.2
N$41
  Bottom 0.61: IC3.15 69.85,47.31 72.07,49.53 72.07,58.42 65.72,64.77 R21.2
N$42
  Bottom 0.61: Q3.2 R26.1 R25.2
N$44
  Bottom 0.813: Q6.4 23.5,70.15 R22.1
N$46
  Top 1.016: U2.P2 X3.4
N$47
  Top 1.016: U2.P3 X3.5
N$48
  Bottom 0.61: IC3.14 68.53,48.58 70.17,50.22 70.17,57.94 66.03,62.08 58.1,62.08 56.83,63.35 R26.2
N$49
  Bottom 0.61: R30.2 R31.1
  Bottom 0.813: Q3.4 54.17,68.22 R31.1
N$51
  Bottom 0.61: Q7.2 18.1,68.58 18.42,68.26 R27.1
N$53
  Top 1.016: C11.+ 74.1,58.29 75.46,56.93 L2.1 | R43.1 70.28,48.06 71.76,49.53 71.76,57.57 76.2,57.57 L2.1 | L2.1 77.05,57.15
  Top 1.524: X8.1 77.05,57.15
N$55
  Bottom 0.61: IC3.13 67.31,49.85 68.43,50.96 68.43,57.15 65.09,60.49 55.88,60.49 54.29,62.08 R31.2
N$56
  Bottom 0.61: Q4.2 R36.1 R35.2
N$58
  Bottom 0.813: Q7.4 15.56,70.15 R32.1
N$60
  Top 1.016: Q9.5 35.24,9.96 | 35.24,9.96 Q9.6 Q9.7 Q9.8 | X1.2 35.24,9.96
N$62
  Bottom 0.61: IC3.12 66.04,51.12 66.67,51.75 66.67,56.51 64.13,59.05 49.85,59.05 45.4,63.5 R36.2
N$63
  Bottom 0.61: R38.2 R41.1
  Bottom 0.813: Q4.4 42.74,68.22 R41.1
N$65
  Bottom 0.61: Q8.2 10.16,64.77 10.48,64.45 R37.1
N$68
  Top 1.016: IC6.2 22.02,31.32 23.18,30.16 23.18,26.45 20.11,23.39 L1.2 18.28,21.55 D5.C
N$69
  Bottom 0.61: IC3.11 65.04,52.39 65.04,55.61 63.18,57.47 48.89,57.47 42.86,63.5 R41.2
N$70
  Bottom 0.813: Q8.4 7.62,66.34 R42.1
N$71
  Top 0.813: IC6.4 24.02,34.72 25.25,33.49 R5.1 R2.2
N$72
  Top 0.813: R12.1 | R12.1 R47.1
  Top 1.016: R47.1 65.29,51.27 64.94,50.91 R43.2 60.88,48.06 59.49,49.45 IC5.4
N$73
  Top 0.813: R28.1 57.95,15.09 55.25,12.38 TR10.B
N$74
  Bottom 1.016: TR12.B R45.1
N$84
  Bottom 0.61: IC1.14 22.54,43.81 24.13,42.23 36.93,42.23 37.19,41.97 IC2.9
N$86
  Bottom 1.016: R45.2 58.1,10.48 54.29,6.67 X1.7
P10
  Top 0.813: U2.P10 66.04,20.64 60.96,15.56 R28.2
P11
  Top 0.813: U2.P11 65.55,23.18 62.38,20 TR12.E
  Bottom 1.016: TR12.E R46.2
P13
  Top 0.813: U2.P13 62.67,28.26 60.45,26.03 R18.1
SH_CP  (via drill 1 pad 2)
  Top 0.61: v28.89,44.77 v28.89,38.73 | v72.71,34.29 72.71,33.66
  Top 0.813: 72.71,33.66 U2.P26
  Bottom 0.61: IC1.11 26.35,47.31 v28.89,44.77 IC2.11 | v28.89,38.73 33.34,34.29 54.93,34.29 57.79,37.15 71.44,37.15 72.71,35.88 v72.71,34.29
ST_CP  (via drill 1 pad 2)
  Top 0.61: v25.08,44.77 v25.08,38.73 | v70.17,34.29 70.17,33.78
  Top 0.813: 70.17,33.78 U2.P15
  Bottom 0.61: v25.08,44.77 IC1.12 25.08,51.81 26,52.73 30.14,52.73 31.43,51.43 31.43,46.99 32.38,46.04 IC2.12 | v25.08,38.73 30.8,33.02 55.56,33.02 58.1,35.56 68.9,35.56 v70.17,34.29
VCC  (via drill 1 pad 2)
  Top 0.813: v12.38,20.95 12.32,21.02 C1.+
  Bottom 1.016: 19.05,21.01 19.05,20.95 v12.38,20.95 33.97,20.95 40.01,14.92 Q10.C 50.65,14.92 R16.1
  Bottom 1.524: R44.2 R48.2 19.05,21.01

### Text on the board
Top: MCU-RPICO V4.5 / @DEV.TGM2024
Bottom: MCU-RPICO V4.5 / @DEV.TGM2024
tValues: C8 C7 C6 C5 C4 C3 C2 C1 | L8 L7 L6 L5 L4 L3 L2 L1 | G 24V | G 5V | ST_CP | SH_CP | DS | RX | TX | P7 | P3 | P2 | P1 | P0 | G | + LOCK - | DS18B20 | (+) IR (-) | G RX TX | UART1 | 24V